# Altium schematic sheet ext_supply.SchDoc: foxBMS BMS-Slave 12-Cell
size A3; DocumentNumber: 11; SheetNumber: 11; SheetTotal: 15; AUTHOR: Fraunhofer IISB foxBMS Team; SheetDescription: External Power Supply
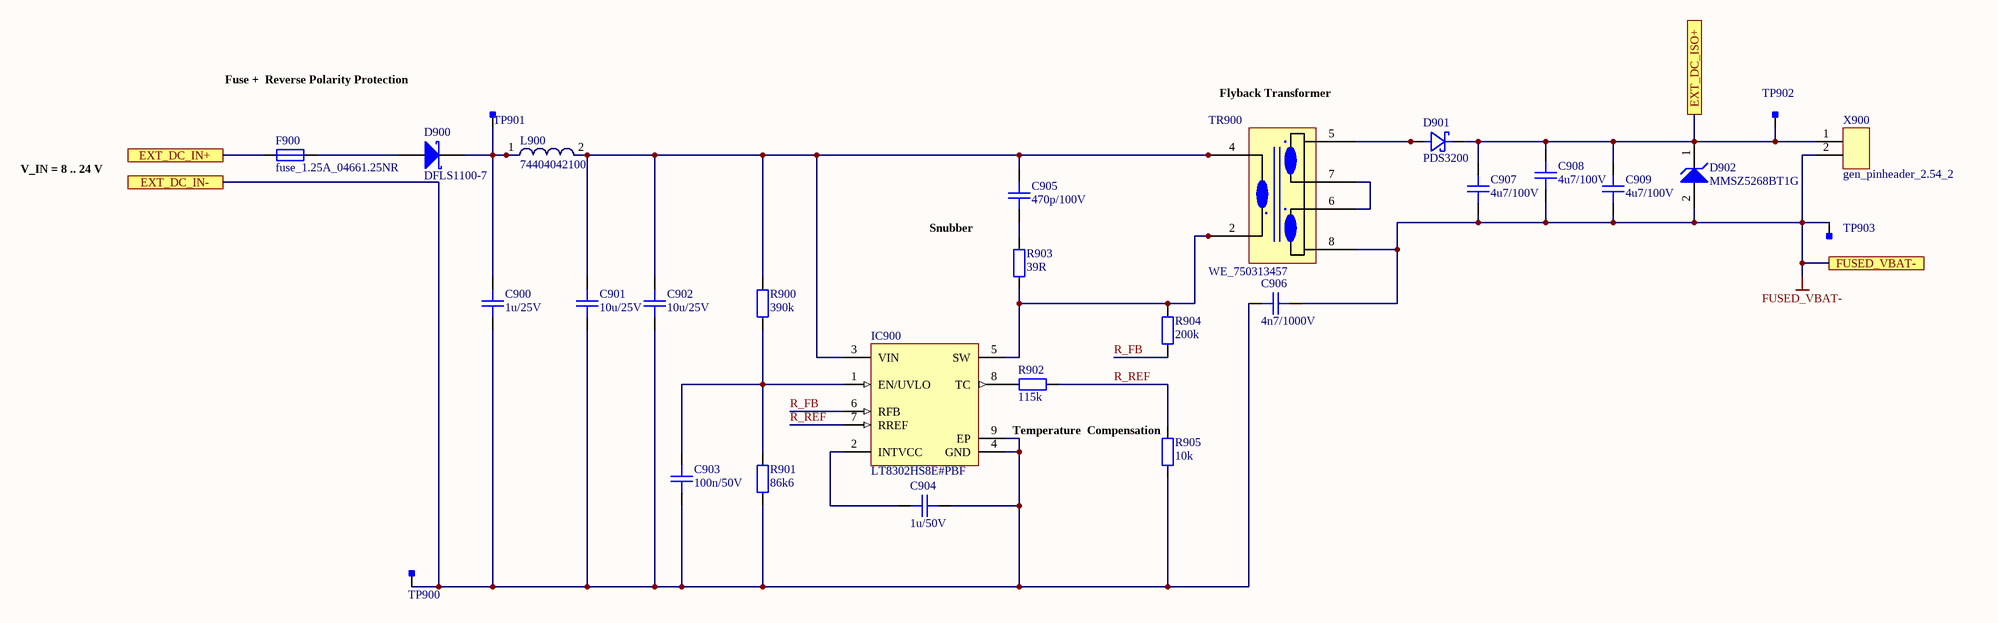
[diagram p0: ext_supply.SchDoc]

## Parts
C900  1u/25V  [CAPC2012X14N]
C901  10u/25V  [CAPC3225X25N]
C902  10u/25V  [CAPC3225X25N]
C903  100n/50V  [CAPC1608X08N]
C904  1u/50V  [CAPC2012X14N]
C905  470p/100V  [CAPC2012X14N]
C906  4n7/1000V  [CAPC4532X16N]
C907  4u7/100V  [CAPC3216X18N]
C908  4u7/100V  [CAPC3216X18N]
C909  4u7/100V  [CAPC3216X18N]
D900  DFLS1100-7  [DIOD-POWERDI123-2_V]
D901  PDS3200  [PowerDI5]
D902  MMSZ5268BT1G  [ONSC-SOD-123-2-425-04_V]
F900  fuse_1.25A_04661.25NR  [LITTLEFUSE_466]
IC900  LT8302HS8E#PBF  [LT-S8E-8_V]
L900  74404042100  [WE-LQS 4018]
R900  390k  [RESC1608X05N]
R901  86k6  [RESC1608X05N]
R902  115k  [RESC1608X05N]
R903  39R  [RESC2012X05N]
R904  200k  [RESC1608X05N]
R905  10k  [RESC1608X05N]
TP900  Testpoint_Square  [Testpoint_S1]  (value not drawn)  (no BOM)
TP901  Testpoint_Square  [Testpoint_S1]  (value not drawn)  (no BOM)
TP902  Testpoint_Square  [Testpoint_S1]  (value not drawn)  (no BOM)
TP903  Testpoint_Square  [Testpoint_S1]  (value not drawn)  (no BOM)
TR900  WE_750313457  [WE_750313457]
X900  gen_pinheader_2.54_2  [Pinheader_2.54_2]

## Ports
EXT_DC_IN+, EXT_DC_IN-, EXT_DC_ISO+, FUSED_VBAT-

## Nets
FUSED_VBAT-: C906.2 C907.1 C908.1 C909.1 D902.2(A) TP903.1 TR900.8 X900.2 ; port FUSED_VBAT-
EXT_DC_IN+: F900.1 ; port EXT_DC_IN+
EXT_DC_IN-: C900.1 C901.1 C902.1 C903.1 C904.1 C906.1 IC900.4(GND) IC900.9(EP) R901.1 R905.1 TP900.1 ; port EXT_DC_IN-
EXT_DC_ISO+: C907.2 C908.2 C909.2 D901.1(C) D902.1(K) TP902.1 X900.1 ; port EXT_DC_ISO+
R_FB: IC900.6(RFB) R904.1
R_REF: IC900.7(RREF) R902.2 R905.2
NetC900_2: C900.2 D900.2(K) L900.1 TP901.1
NetC901_2: C901.2 C902.2 C905.2 IC900.3(VIN) L900.2 R900.2 TR900.3 TR900.4
NetC903_2: C903.2 IC900.1(EN/UVLO) R900.1 R901.2
NetC904_2: C904.2 IC900.2(INTVCC)
NetC905_1: C905.1 R903.2
NetD900_1: D900.1(A) F900.2
NetD901_2: D901.2(A) D901.3(A) TR900.5
NetIC900_5: IC900.5(SW) R903.1 R904.2 TR900.1 TR900.2
NetIC900_8: IC900.8(TC) R902.1
NetTR900_6: TR900.6 TR900.7

## Notes on the sheet
- Fuse +
  Reverse Polarity Protection
- (near TR900) Flyback Transformer
- V_IN = 8 .. 24 V
- Snubber
- (near R905) Temperature
  Compensation
- Fraunhofer IISB
- Schottkystr. 10
- developed by:
- 91058 Erlangen
- Germany
- Author
- Project
- License
- Description
- File
- Version
- Release Date
- Sheet
- www.foxbms.org
- www.iisb.fraunhofer.de
- foxBMS Team
- /

## Library data of the parts
C900 = gen_C_ceramic_1u_25V_X7R_0805: MLCC; Capacitance: 1u; Rated Voltage: 25V; Dielectric: X7R; Case EIA: 0805; Case Metric: 2012; PnP Package: C_0805_10; PnP Value: 1uF/25V/X7R; PnP equipped: x; Automotive Qualified: True; Part Number: gen_C_ceramic_1u_25V_X7R_0805; Supplier 1: Farnell; Supplier Part Number 1: 1833845; Supplier 2: Farnell; Supplier Part Number 2: 2464627; Supplier 3: Farnell; Supplier Part Number 3: 2478267
C901 C902 = gen_C_ceramic_10u_25V_X7R_1210: MLCC; Capacitance: 10u; Rated Voltage: 25V; Dielectric: X7R; Case EIA: 1210; Case Metric: 3225; AVT Set: x; Automotive Qualified: True; Part Number: gen_C_ceramic_10u_25V_X7R_1210; Supplier 1: Farnell; Supplier Part Number 1: 1833857; Supplier 2: Farnell; Supplier Part Number 2: 2470445; Supplier 3: Farnell; Supplier Part Number 3: 2478277
C903 = gen_C_ceramic_100n_50V_X7R_0603: MLCC; Capacitance: 100n; Rated Voltage: 50V; Dielectric: X7R; Case EIA: 0603; Case Metric: 1608; PnP Package: C_0603_10; PnP Value: 100n/50V/X7R; PnP equipped: x; Automotive Qualified: True; Part Number: gen_C_ceramic_100n_50V_X7R_0603; Supplier 1: Farnell; Supplier Part Number 1: 2525267; Supplier 2: Digikey; Supplier Part Number 2: 490-6049-1-ND; Supplier 3: Farnell; Supplier Part Number 3: 2070398
C904 = gen_C_ceramic_1u_50V_X7R_0805: MLCC; Capacitance: 1u; Rated Voltage: 50V; Dielectric: X7R; Case EIA: 0805; Case Metric: 2012; Automotive Qualified: True; Tolerance: ± 10%; AVT Set: x; Part Number: gen_C_ceramic_1u_50V_X7R_0805; Supplier 1: Farnell; Supplier Part Number 1: 2672199; Operating Temperature: -55°C - +125°C; Supplier 2: Farnell; Supplier Part Number 2: 2479894; Supplier 3: Farnell; Supplier Part Number 3: 2464630
C905 = gen_C_ceramic_470p_100V_X7R_0805: MLCC; Capacitance: 470p; Rated Voltage: 100V; Dielectric: X7R; Case EIA: 0805; Case Metric: 2012; Automotive Qualified: True; Part Number: gen_C_ceramic_470p_100V_X7R_0805; Supplier 1: Farnell; Supplier Part Number 1: 2070482
C906 = gen_C_ceramic_4n7_1000V_X7R_1812: MLCC; Capacitance: 4n7; Rated Voltage: 1000V; Dielectric: X7R; Case EIA: 1812; Case Metric: 4532; Automotive Qualified: True; Part Number: gen_C_ceramic_4n7_1000V_X7R_1812; Supplier 1: Farnell; Supplier Part Number 1: 2834565
C907-C909 = gen_C_ceramic_4u7_100V_X7S_1206: MLCC; Capacitance: 4u7; Rated Voltage: 100V; Dielectric: X7S; Case EIA: 1206; Case Metric: 3216; AVT Set: x; Automotive Qualified: False; Part Number: gen_C_ceramic_4u7_100V_X7S_1206; Supplier 1: Digikey; Supplier Part Number 1: 478-8719-1-ND
D900 = CMP-2000-05099-1: 1 A High Voltage Schottky Barrier Rectifier, 0.62 V, -55 to 175 degC, 2- Pin POWERDI123, Pb-Free, Tape and Reel; Manufacturer: Diodes Inc; Average Rectified Current-Max: 1A; Peak Current-Max: 40A; Forward Voltage: 0.77V; Reverse Current-Max: 1µA; Reverse Voltage-Max [Vrrm]: 100V; Datasheet Version: Sep-14; Datasheet URL: https://datasheet.ciiva.com/15144/getdatasheetpartid-44146-15144126.pdf; Manufacturer URL: http://www.diodes.com/
D901 = PDS3200-13: Schottky Diode 3A 200V 780mV; Manufacturer: DIODES Inc; Automotive Qualified: True; Part Number: PDS3200-13; Part Name: PDS3200; Operating Temperature: -65°C - +150°C; Breakdown Voltage: 200V; Continuous Forward Current: 3A; ComponentLink1Description: Datasheet; ComponentLink1URL: http://www.farnell.com/datasheets/2238298.pdf; Supplier 1: Farnell; Supplier Part Number 1: 1713904
D902 = CMP-1060-00362-1: Zener Voltage Regulator, 500 mW, 2-Pin SOD-123, Pb-Free, Tape and Reel; Manufacturer: On Semiconductor; VZ Typ (V): 82; P Max (W): 0.5; DatasheetVersion: Rev. 12; PackageReference: SOD-123-2-425-04; Mounting Technology: Surface Mount; ComponentLink3URL: http://www.onsemi.com/pub_link/Collateral/425-04.PDF; ComponentLink1Description: Manufacturer URL; ComponentLink3Description: Package Specification; PartNumber: MMSZ5268BT1G; PackageDescription: 2-Pin SOD, Body 1.6 x 2.69 mm; Packing: Tape and Reel; ComponentLink1URL: http://www.onsemi.com/; RoHS: Pb-Free; ComponentLink2Description: Datasheet; ComponentLink2URL: http://www.onsemi.com/pub_link/Collateral/MMSZ5221BT1-D.PDF; PackageVersion: Rev. G, 10/2009
F900 = fuse_1.25A_04661.25NR: Fuse, Surface Mount, 466 Series, 1.25 A, 63 VAC, 63 VDC, Very Fast Acting, 1206; Manufacturer: Littlefuse; Automotive Qualified: False; Part Number: fuse_1.25A_04661.25NR; Operating Temperature: -55°C - +90°C; ComponentLink1Description: Datasheet; ComponentLink1URL: http://www.farnell.com/datasheets/1796765.pdf; Supplier 1: Farnell; Supplier Part Number 1: 1596526
IC900 = CMP-0492-02715-1: Micropower No-Opto Isolated Flyback Converter, 2.8 to 42 V, -40 to 150 degC, 8-Pin SOIC (S8E), RoHS, Tube; PartNumber: LT8302; Output Current: 3.6 A; Number of Outputs: 1; VIN Min: 2.8 V; VIN Max: 42 V; ComponentLink2Description: Datasheet; Temperature Min: -40 degC; PackageDescription: 8-Pin Plastic Small Outline Integrated Circuit Package, Body 4.90 x 3.90 mm, Pitch 1.27 mm; Temperature Max: 150 degC; ComponentLink1URL: http://www.linear.com/; ComponentLink3URL: http://cds.linear.com/docs/en/packaging/05081857_A_S8E.pdf; PackageVersion: Rev. A, 10/2013; Packing: Tube; RoHS: TRUE; DatasheetVersion: Rev. A; ComponentLink2URL: http://cds.linear.com/docs/en/datasheet/8302fa.pdf; Mounting Technology: Surface Mount; ComponentLink1Description: Manufacturer URL; ComponentLink3Description: Package Specification
L900 = CMP-1354-00028-1: WE-LQS SMD Power Inductor, L=10 µH; Manufacturer: Wuerth Elektronik; Inductance: 10 ÂµH; ComponentLink2URL: http://katalog.we-online.de/pbs/datasheet/74404042100.pdf; PartNumber: 74404042100; ComponentLink2Description: Datasheet; PackageReference: WE-LQS 4018; ComponentLink1URL: http://www.we-online.com; ComponentLink1Description: Manufacturer URL
R900 = gen_R_390k_0603: SMD Resistor 390k 0603; Tolerance: 1%; Power: 0.1W; Case EIA: 0603; Case Metric: 1608; Maximum Working Voltage: 75V; PnP Package: R_0603; Automotive Qualified: True; Part Number: gen_R_390k_0603; Operating Temperature: -55°C - +155°C; Resistance: 390k; Series: E24; PnP Value: 390k; Supplier 1: Farnell; Supplier Part Number 1: 2303278
R901 = gen_R_86k6_0603: SMD Resistor 86k6 0603; Tolerance: 1%; Power: 0.1W; Case EIA: 0603; Case Metric: 1608; Maximum Working Voltage: 75V; PnP Package: R_0603; Automotive Qualified: True; Part Number: gen_R_86k6_0603; Operating Temperature: -55°C - +155°C; Resistance: 86k6; Series: E96; PnP Value: 86k6; Supplier 1: Farnell; Supplier Part Number 1: 2059490
R902 = gen_R_115k_0603: SMD Resistor 115k 0603; Tolerance: 1%; Power: 0.1W; Case EIA: 0603; Case Metric: 1608; Maximum Working Voltage: 75V; PnP Package: R_0603; Automotive Qualified: True; Part Number: gen_R_115k_0603; Operating Temperature: -55°C - +155°C; Resistance: 115k; Series: E96; PnP Value: 115k; Supplier 1: Farnell; Supplier Part Number 1: 2073367
R903 = gen_R_39R_0805: SMD Resistor 39R 0805; Tolerance: 1%; Power: 0.125W; Case EIA: 0805; Case Metric: 2012; Maximum Working Voltage: 150V; PnP Package: R_0805; Automotive Qualified: True; Part Number: gen_R_39R_0805; Operating Temperature: -55°C - +155°C; Resistance: 39R; Series: E24; PnP Value: 39R; Supplier 1: Farnell; Supplier Part Number 1: 1750736
R904 = gen_R_200k_0603: SMD Resistor 200k 0603; Tolerance: 1%; Power: 0.1W; Case EIA: 0603; Case Metric: 1608; Maximum Working Voltage: 75V; PnP Package: R_0603; Automotive Qualified: True; Part Number: gen_R_200k_0603; Operating Temperature: -55°C - +155°C; Resistance: 200k; Series: E24, E96; PnP Value: 200k; Supplier 1: Farnell; Supplier Part Number 1: 2059509
R905 = gen_R_10k_0603: SMD Resistor 10k 0603; Tolerance: 1%; Power: 0.1W; Case EIA: 0603; Case Metric: 1608; Maximum Working Voltage: 75V; PnP Package: R_0603; Automotive Qualified: True; Part Number: gen_R_10k_0603; Operating Temperature: -55°C - +155°C; Resistance: 10k; Series: E24, E96; PnP Value: 10k; Supplier 1: Farnell; Supplier Part Number 1: 2073349
TP900-TP903 = Testpoint_Square: Testpoint, square; Part Number: Testpoint_Square
TR900 = WE_750313457: MID-FLYLT Flyback Transformers for Linear Technology; Manufacturer: Würth Elektronik; Automotive Qualified: False; Part Number: WE_750313457; ComponentLink1Description: Datasheet; ComponentLink1URL: http://katalog.we-online.de/ctm/datasheet/750313457.pdf; ComponentLink2Description: Website; ComponentLink2URL: http://katalog.we-online.de/en/ctm/MID-FLYLT/750313457; Supplier 1: Digikey; Supplier Part Number 1: 1297-1136-1-ND
X900 = gen_pinheader_2.54_2: Standard Pinheader, THD, gerade, 2.54mm; Circuits: 2; Rated Voltage: 250V; Rated Current: 3A; Automotive Qualified: False; Part Number: gen_pinheader_2.54_2; Part Name: PinHeader; Operating Temperature: −40 °C - +105 °C; Supplier 1: Farnell; Supplier Part Number 1: 2025248